# Altium schematic sheet lpc4357-save.SchDoc
size B; Organization: Altium Limited; Address1: 3 Minna Close; Address2: Belrose; Address3: NSW 2085; Address4: Australia; SheetNumber: 1; SheetTotal: 1; PROJECT_ENGINEER: E. Hughes; SCH_DATE: 2017-11-01; PAGE_TITLE: -
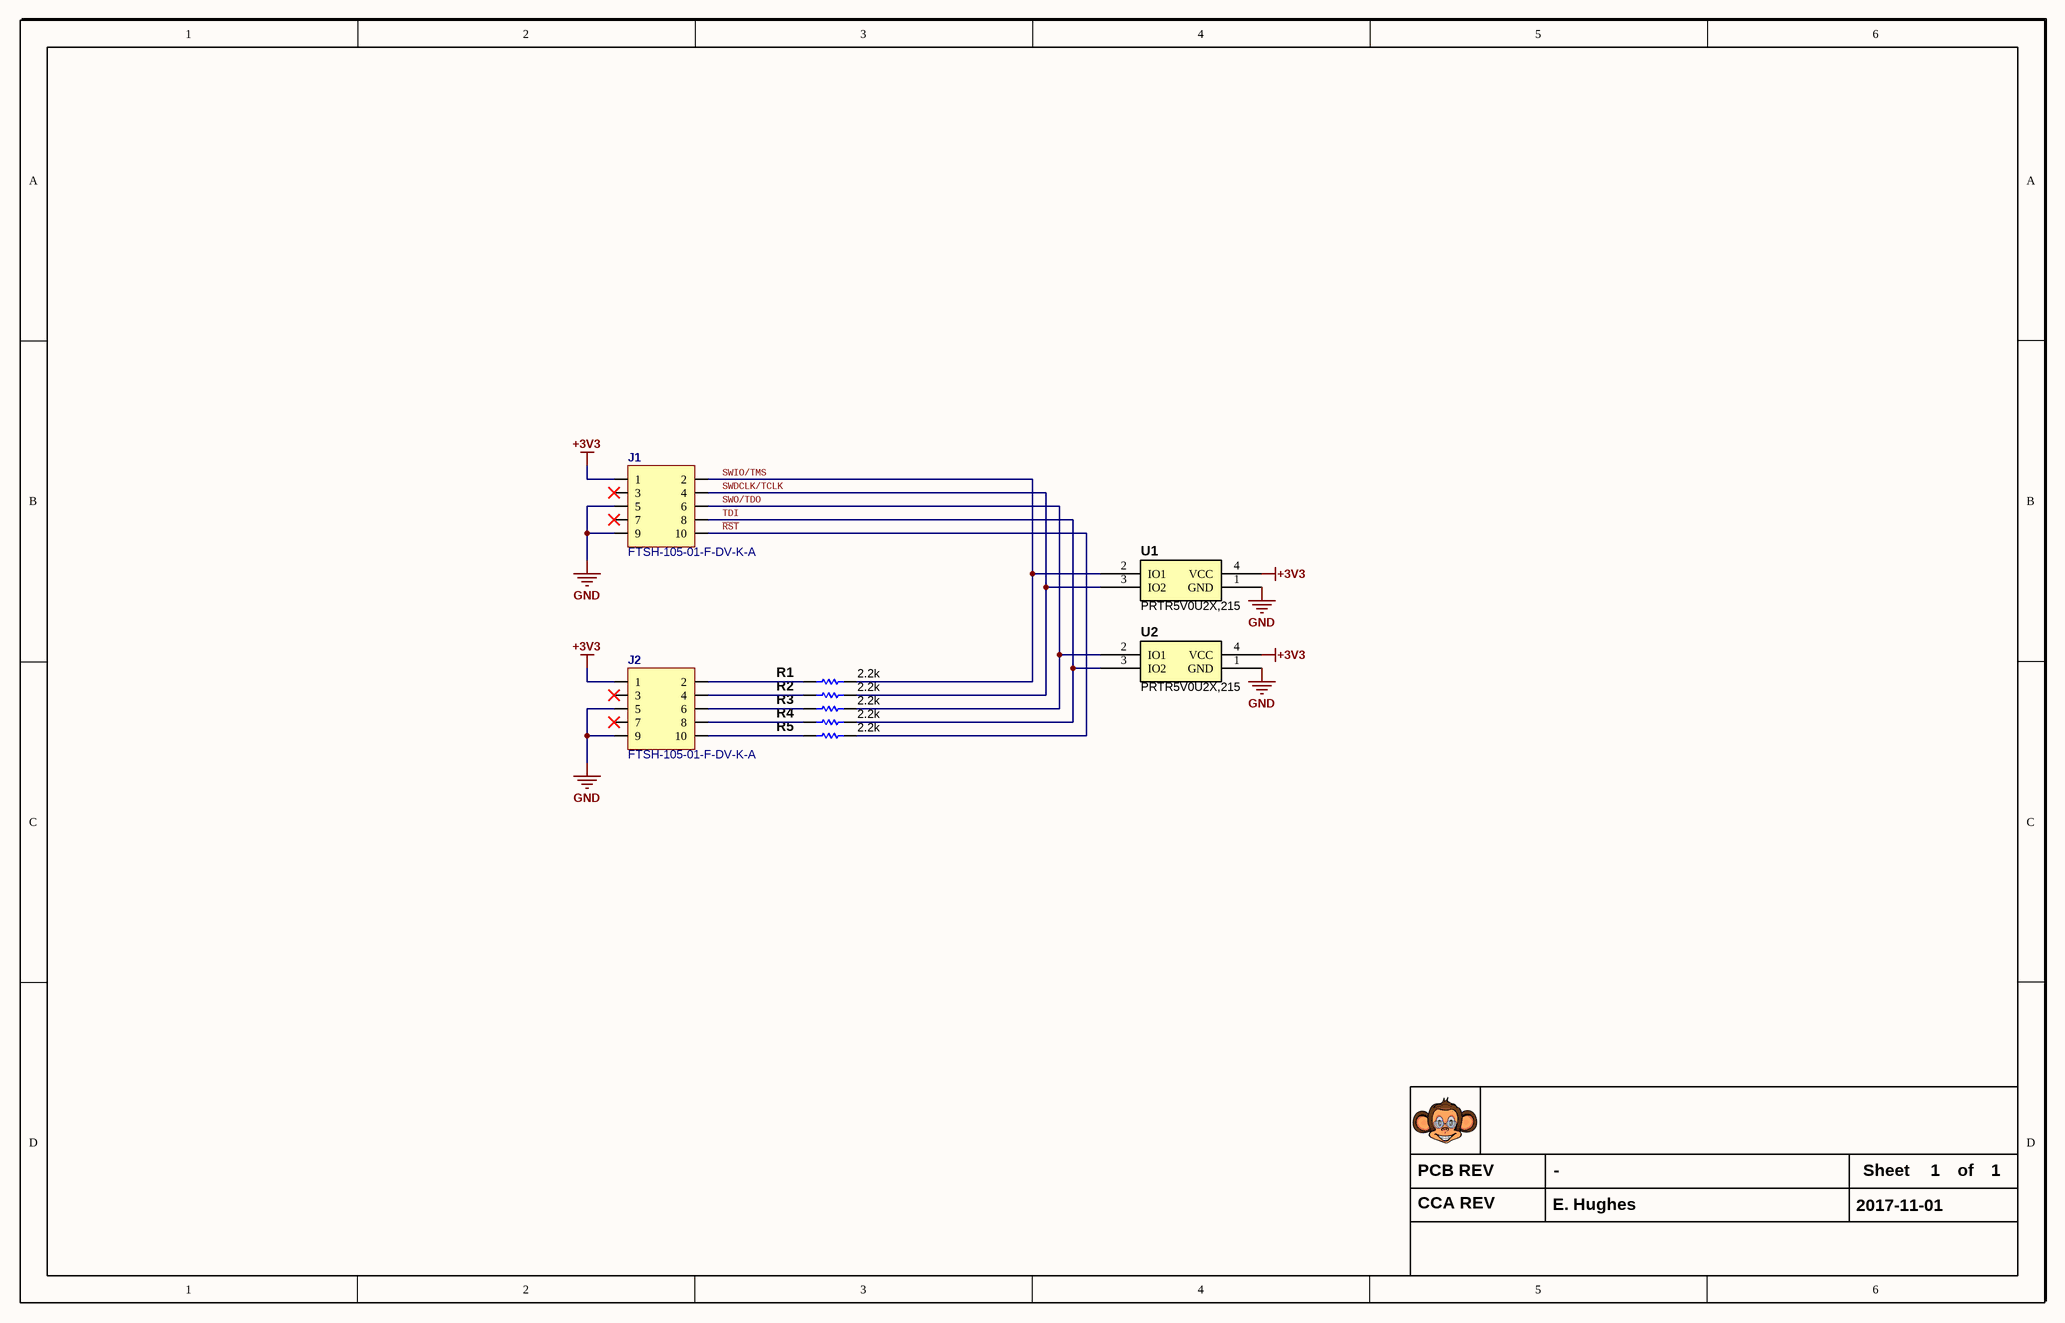
[diagram p0: lpc4357-save.SchDoc]

## Parts
J1  FTSH-105-01-F-DV-K-A  [FTSH-105-01-F-DV-K-A]
J2  FTSH-105-01-F-DV-K-A  [FTSH-105-01-F-DV-K-A]
R1  2.2k  [R0603_0.55MM_MD]
R2  2.2k  [R0603_0.55MM_MD]
R3  2.2k  [R0603_0.55MM_MD]
R4  2.2k  [R0603_0.55MM_MD]
R5  2.2k  [R0603_0.55MM_MD]
U1  PRTR5V0U2X,215  [SOT143B]
U2  PRTR5V0U2X,215  [SOT143B]

## Nets
+3V3: J1.1 J2.1 U1.4(VCC) U2.4(VCC)
GND: J1.5 J1.9 J2.5 J2.9 U1.1(GND) U2.1(GND)
~{RST}: J1.10 R5.2
SWDCLK/TCLK: J1.4 R2.2 U1.3(IO2)
SWIO/TMS: J1.2 R1.2 U1.2(IO1)
SWO/TDO: J1.6 R3.2 U2.2(IO1)
TDI: J1.8 R4.2 U2.3(IO2)
NetJ2_2: J2.2 R1.1
NetJ2_4: J2.4 R2.1
NetJ2_6: J2.6 R3.1
NetJ2_8: J2.8 R4.1
NetJ2_10: J2.10 R5.1

Not connected (* = marked no-connect by the designer): J1 3* 7*; J2 3* 7*

## Notes on the sheet
- PCB REV
- Sheet
- of
- CCA REV

## Library data of the parts
J1 J2 = FTSH-105-01-F-DV-K-A: CONN HEADER 10POS DUAL .05" SMD; Manufacturer: Samtec Inc; CategorySort: 800; Connector Type: Header, Unshrouded; Number of Positions: 10; Number of Positions Loaded: All; Pitch: 0.050" (1.27mm); Value: FTSH-105-01-F-DV-K-A; Sort Value: *; Category: Connectors; Supplier 1: Digi-Key; Supplier Part Number 1: FTSH-105-01-F-DV-K-A-ND; Manufacturer Part Number: FTSH-105-01-F-DV-K-A; RoHS: RoHS Compliant; Stock 1: 0; Pricing 1: 1=3.59 (USD); Packaging: Tube; Contact Type: Male Pin; Number of Rows: 2; Row Spacing: 0.050" (1.27mm); Contact Mating Length: 0.120" (3.05mm); Mounting Type: Surface Mount; Termination: Solder; Fastening Type: -; Features: -; Contact Finish: Gold; Contact Finish Thickness: 3µin (0.08µm); Color: Black; ComponentLink1URL: http://www.samtec.com/documents/webfiles/cpdf/FTSH-1XX-XX-XXX-DV-XXX-MKT.pdf; ComponentLink1Description: http://www.samtec.com/documents/webfiles/cpdf/FTSH-1XX-XX-XXX-DV-XXX-MKT.pdf
R1-R5 = ERJ-3EKF2201V: RES 2.2K OHM 1/10W 1% 0603 SMD; Manufacturer: Panasonic Electronic Components; Package Power: 0603  (0.1W); Power (Watts): 0.1W- 1/10W; Temperature Coefficient: ±100ppm/°C; Limiting Element Voltage: 75; Maximum Overload Voltage: 150; Maximum Working Voltage: 14.8V; Substitution Notes: 2.2k , ±1% , 0603 , AEC-Q200; Value: 2.2k; Manufacturer Part Number: ERJ-3EKF2201V; ComponentLink1Description: Internal Datasheet; ComponentLink1URL: datasheets\Panasonic Electronic Components\AOA0000CE2.pdf; ComponentLink2Description: External Datasheet; ComponentLink2URL: http://industrial.panasonic.com/www-data/pdf/AOA0000/AOA0000CE2.pdf; Supplier 1: Digi-Key; Supplier Part Number 1: P2.20KHCT-ND; Category: Resistors; Resistance (Ohms): 2.2k; Composition: Thick Film; Features: -; Tolerance: ±1%; Package: 0603 (1608 Metric); Supplier Package: 0603; Size / Dimension: 0.063" L x 0.031" W (1.60mm x 0.80mm); Height: 0.55MM; Number of Terminations: 2; Packaging: Cut Tape (CT); Sort Value: 2200; Sort Value Package: 603_2200; Ratings: AEC-Q200
U1 U2 = PRTR5V0U2X,215: TVS DIODE 5.5VWM SOT143B; Manufacturer: NXP Semiconductors; Bidirectional Channels: 2; Voltage - Reverse Standoff (Typ): 5.5V (Max); Voltage - Breakdown (Min): 6V; Power Line Protection: Yes; Capacitance @ Frequency: 1pF @ 1MHz; Supplier 1: Digi-Key; Supplier Part Number 1: 568-4140-1-ND; Manufacturer Part Number: PRTR5V0U2X,215; RoHS: RoHS Compliant; Category: Circuit Protection; Stock: 11734; Pricing: 1=0.57, 10=0.477, 25=0.418, 100=0.3578, 250=0.31036, 500=0.26286, 1000=0.20265 (USD); Packaging: Cut Tape (CT); Type: Steering (Rail to Rail); Unidirectional Channels: -; Voltage - Clamping (Max) @ Ipp: -; Current - Peak Pulse (10/1000µs): -; Power - Peak Pulse: -; Applications: General Purpose; Operating Temperature: -40°C ~ 85°C (TA); Mounting Type: Surface Mount; Package / Case: TO-253-4, TO-253AA; Supplier Device Package: SOT-143B; ComponentLink1URL: http://www.nxp.com/documents/data_sheet/PRTR5V0U2X.pdf; ComponentLink1Description: http://www.nxp.com/documents/data_sheet/PRTR5V0U2X.pdf; Value: PRTR5V0U2X,215